# Altium schematic sheet I2C-E2PROM.SchDoc: I2C-E2PROM
size A4
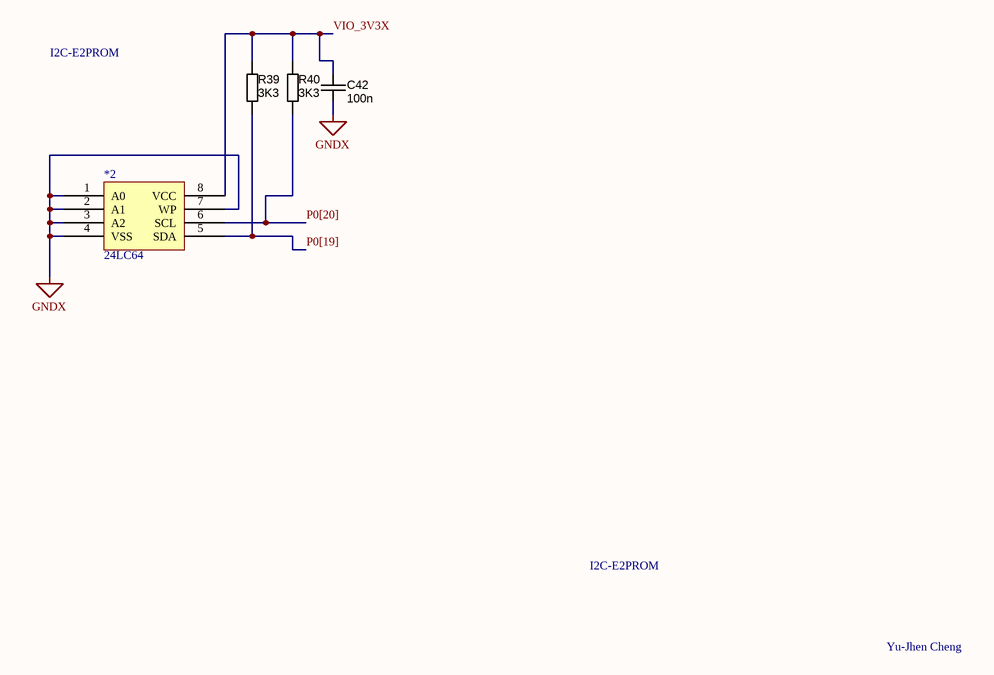
[diagram p0: I2C-E2PROM.SchDoc]

## Parts
*2  24LC64  [DFN-MD8]
C42  value 100n  [CAPC2012N]  (hidden comment: approved sub OK)
R39  value 3K3  [RESC1005N]  (hidden comment: Thick Film)
R40  value 3K3  [RESC1005N]  (hidden comment: Thick Film)

## Nets
GNDX: *2.1(A0) *2.2(A1) *2.3(A2) *2.4(VSS) *2.7(WP) C42.1
P0[19]: *2.5(SDA) R39.2
P0[20]: *2.6(SCL) R40.2
VIO_3V3X: *2.8(VCC) C42.2 R39.1 R40.1

## Notes on the sheet
- I2C-E2PROM
- Yu-Jhen Cheng

## Library data of the parts
C42 = CAPC_100n_0805: Capacitor SMD Cer 100nF 10% 50V X7R 0805; Manufacturer 1: Kemet; Manufacturer Part Number 1: C0805C104K5RACTU; Tolerance: ?0%; Ratings: 50V; X7R; Material: ceramic; Package / Case: 0805 (2012 metric); Supplier 1: Digi-Key; Supplier Part Number 1: 399-1170-1-ND
R39 R40 = RES_330R_0402_5%: Resistor SMD chip 330 Ohm 0.063W 5% 0402; Manufacturer 1: Yageo; Manufacturer Part Number 1: RC0402JR-07330RL; Ratings: 1/16 W; Tolerance: ?%; Package / Case: 0402 (1005 Metric); Supplier 1: Digi-Key; Supplier Part Number 1: 311-330JRCT-ND; ComponentLink1URL: http://www.yageo.com/documents/recent/PYu-RC0402_51_RoHS_L_6.pdf; ComponentLink1Description: http://www.yageo.com/documents/recent/PYu-RC0402_51_RoHS_L_6.pdf